# EAGLE design Own_21700_Board_v2.0_Final_AR (EAGLE 9.6.2)
COMPANY: ADAFRUIT INDUSTRIES; DRAWN: KTOWN; REV: A; YEAR: 2019
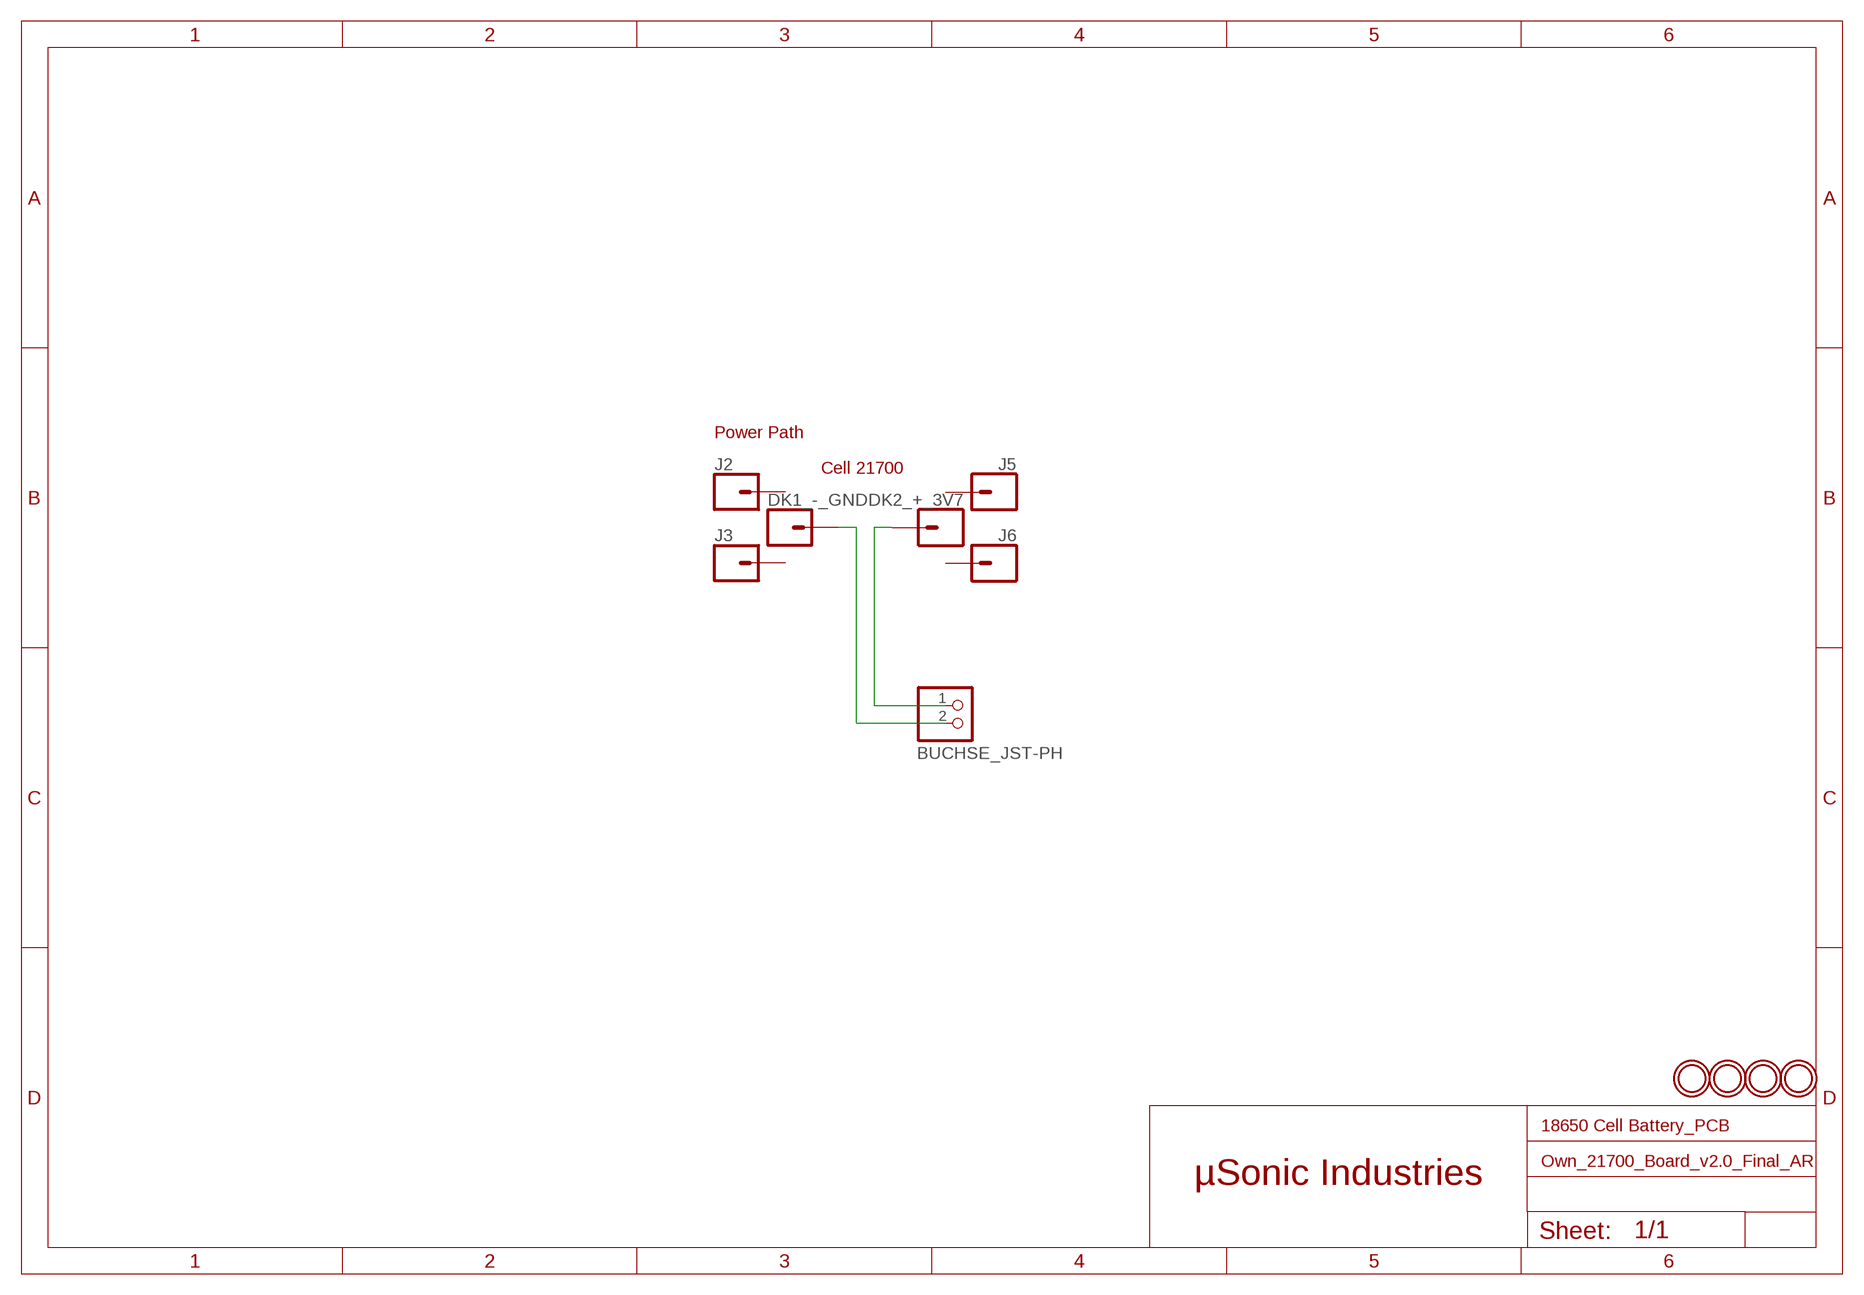
[diagram p0: schematic, sheet 1]

## Parts
BUCHSE_JST-PH  JST_2PINOWN  [JST-PH-2-THMOWN]
DK1_-_GND  CONN_01PTH_2MM  [1X01_2MM]
DK2_+_3V7  CONN_01PTH_2MM  [1X01_2MM]
J2  CONN_01PTH_2MM  [1X01_2MM]
J3  CONN_01PTH_2MM  [1X01_2MM]
J5  CONN_01PTH_2MM  [1X01_2MM]
J6  CONN_01PTH_2MM  [1X01_2MM]
U$1  MOUNTINGHOLE2.5  [MOUNTINGHOLE_2.5_PLATED]
U$2  MOUNTINGHOLE2.5  [MOUNTINGHOLE_2.5_PLATED]
U$3  MOUNTINGHOLE2.5  [MOUNTINGHOLE_2.5_PLATED]
U$5  MOUNTINGHOLE2.5  [MOUNTINGHOLE_2.5_PLATED]

## Nets
3V7: BUCHSE_JST-PH.1 DK2_+_3V7.1
GND: BUCHSE_JST-PH.2 DK1_-_GND.1
Unconnected: J2.1 J3.1 J5.1 J6.1

## Notes on the sheet
- Power Path
- Cell 21700
- 18650 Cell Battery_PCB
- µSonic Industries

## Library data of the parts
BUCHSE_JST-PH = adafruit2:JST_2PIN: JST 2-Pin Connectors of various flavors SMT-RA (S2B-PH-SM4) 4UConnector #17311 SMT (B2B-PH-SM4) THM-RA (S2B-PH) THM (B2B-PH)
DK1_-_GND DK2_+_3V7 J2 J3 J5 J6 = SparkFun-Connectors:CONN_01: Single connection point. Often used as Generic Header-pin footprint for 0.1 inch spaced/style header connections On any of the 0.1 inch spaced packages, you can populate with these: Break Away Headers - Straight <https://www.sparkfun.com/products/116> (PRT-00116) Break Away Male Headers - Right Angle <https://www.sparkfun.com/products/553> (PRT-00553) Female Headers <https://www.sparkfun.com/products/115> (PRT-00115) Break Away Headers - Machine Pin <https://www.sparkfun.com/products/117> (PRT-00117) Break Away Female Headers - Swiss Machine Pin <https://www.sparkfun.com/products/743> (PRT-00743) This device is also useful as a general connection point to wire up your design to another part of your project. Our various solder wires solder well into these plated through hole pads. Hook-Up Wire - Assortment (Stranded, 22 AWG) <https://www.sparkfun.com/products/11375> (PRT-11375) Hook-Up Wire - Assortment (Solid Core, 22 AWG) <https://www.sparkfun.com/products/11367> (PRT-11367) View the entire wire category on our website here <https://www.sparkfun.com/categories/141> Special notes: SMTSO-256-ET is a "flush mount" nut for a 4-40 screw. We mostly use this on specialty testbeds; it is a nice way to connect hardware to your PCB at an adjustable hieght. Also note, the SNAP packages are for using a snappable style connector. We sell a baggie of snaps and they are also used on two LilyPad designs: Snap Assortment - 30 pack (male and female) <https://www.sparkfun.com/products/11347> (DEV-11347) LilyPad Arduino SimpleSnap <https://www.sparkfun.com/products/10941> (DEV-10941) LilyPad SimpleSnap Protoboard <https://www.sparkfun.com/products/10940> (DEV-10940)
U$1-U$3 U$5 = microbuilder:MOUNTINGHOLE: Mounting Hole For #2 screws (0.086"/2.18mm width, 0.094"/2.4mm hole) use 2.5mm; BOM: EXCLUDE

## Net classes
0 default: width 0.25 mm

## Board
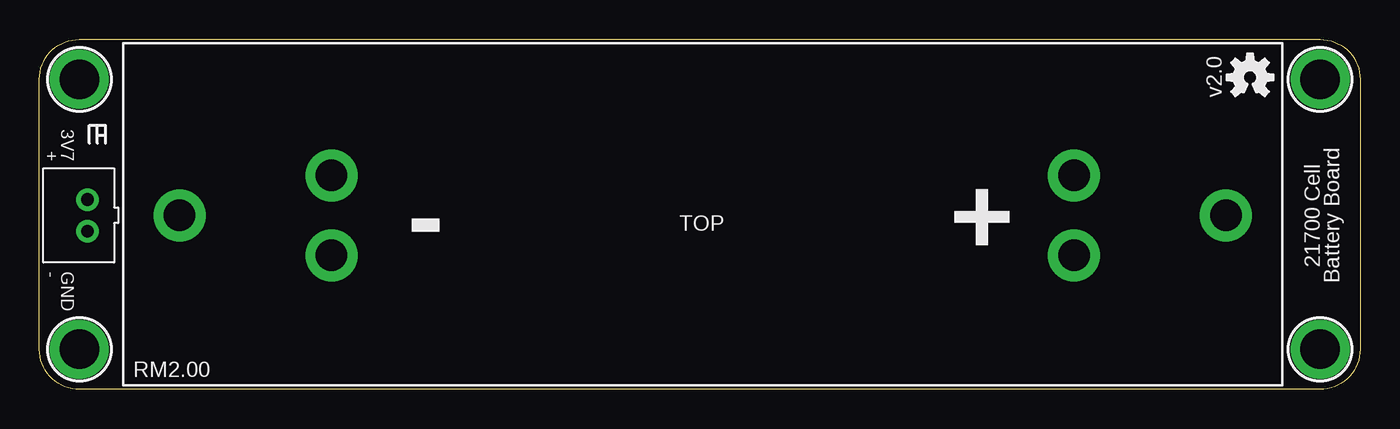
[diagram p1: board, top side]
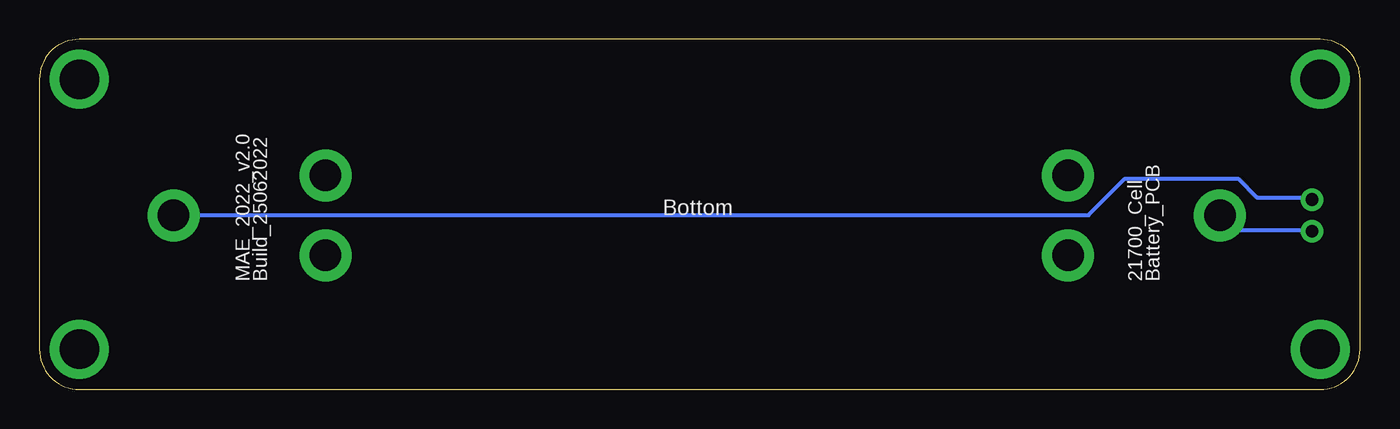
[diagram p2: board, bottom side, seen from below]

Size 83.82 x 22.23 mm. Coordinates in mm from the lower left corner, seen from the top.
Outline: 83.82,19.68 83.82,2.54 arc-90 81.28,0 2.54,0 arc-90 0,2.54 0,19.68 arc-90 2.54,22.23 81.28,22.23 arc-90 83.82,19.68
Copper layers (1*16): Top 0.035mm / dielectric 1.5mm / Bottom 0.035mm
Design rules "aisler_2_layer_complex": minimum track width 0.125mm, minimum drill 0.2mm, track to track 0.125mm, track to pad 0.125mm, pad to pad 0.125mm, via to via 0.125mm, smd to smd 0.125mm, copper to edge 0.3mm, drill to drill 0.25mm, minimum pad ring 0.2mm, minimum via ring 0.2mm, stop-mask expansion 0mil, vias tented up to drill 0mil, thermal gap 10mil

### Footprints (pad centres in the part's own frame; a part is rotated, then mirrored left to right if it is on the bottom)
JST-PH-2-THMOWN = drill 0.8 pad 1.422: 1 1,0; 2 -1,0
1X01_2MM = drill 2 pad 3.302: 1 0,0
MOUNTINGHOLE_2.5_PLATED = drill 2.5 pad 3.2: P$1 0,0

### Placement (x,y rotation side)
BUCHSE_JST-PH  3.05,11.05 90 top
DK1_-_GND  8.89,11.05 0 top
DK2_+_3V7  75.31,11.05 0 top
J2  18.54,13.59 0 top
J3  18.54,8.51 0 top
J5  65.66,13.59 0 top
J6  65.66,8.51 0 top
U$1  81.28,19.68 180 top
U$2  2.54,19.68 180 top
U$3  81.28,2.54 0 top
U$4  [OSHW-LOGO-S]  76.83,19.81 0 top
U$5  2.54,2.54 0 top

### Tracks (layer width: path | path; a pad name or v marks a point on that pad's centre or on a via)
3V7  (via drill 0.35)
  Top 0.25: v75.19,11.06 DK2_+_3V7.1
  Bottom 0.25: v75.19,11.06 17.23,11.06 14.91,13.38 7.74,13.38 6.55,12.19 3.19,12.19 BUCHSE_JST-PH.1
GND
  Bottom 0.25: BUCHSE_JST-PH.2 3.19,10.12 8.06,10.12 8.81,10.88 DK1_-_GND.1

### Text on the board
tPlace: v2.0 | 3V7 / + | - | TOP | + | 21700 Cell / Battery Board | GND / - | RM2.00
bPlace: Bottom | 21700_Cell / Battery_PCB | MAE_2022_v2.0 / Build_25062022